# Altium project ТЕИЯ.464511.002 main.PrjPcb (part 3 of 3)

## Sheet Модуль ВЧ.SchDoc
size 594 x 420 mm; DocumentNumber: 9; SheetNumber: 9; SheetTotal: 11; ListNumber: 1
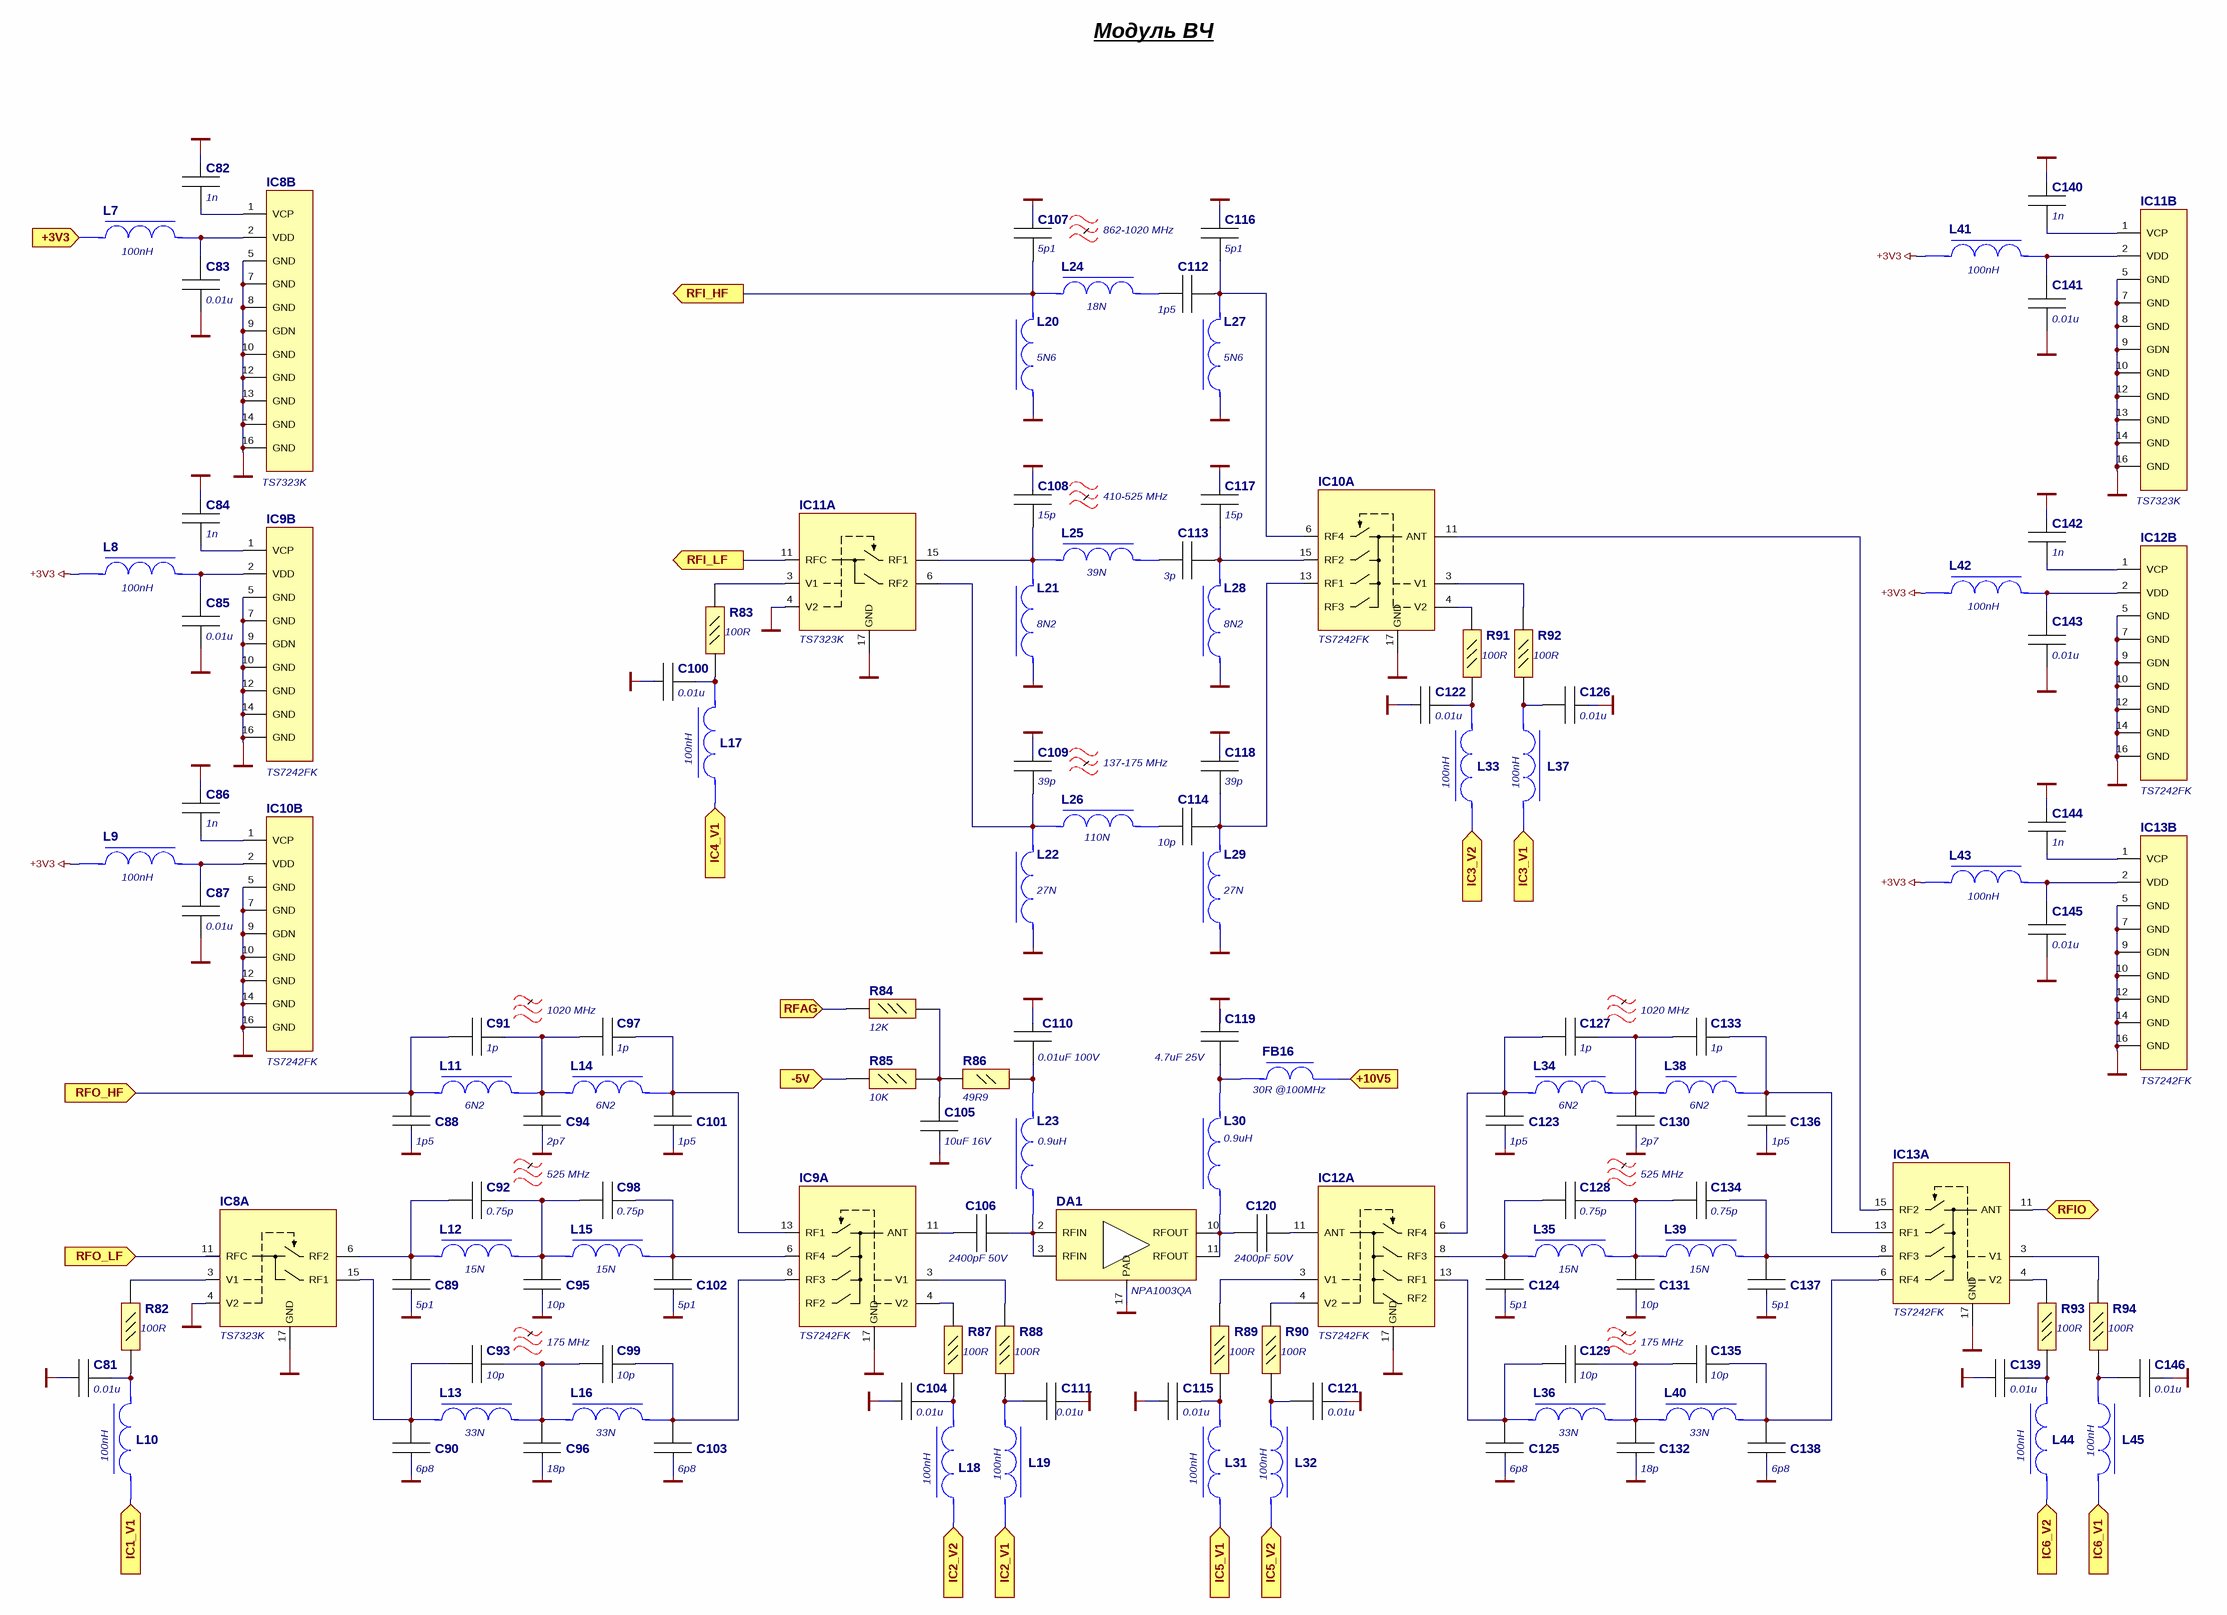
[diagram p8: Модуль ВЧ.SchDoc]

### Parts
C81  0.01u  [:CAP0402 100x50x50]
C82  1n  [:CAP0402 100x50x50]
C83  0.01u  [:CAP0402 100x50x50]
C84  1n  [:CAP0402 100x50x50]
C85  0.01u  [:CAP0402 100x50x50]
C86  1n  [:CAP0402 100x50x50]
C87  0.01u  [:CAP0402 100x50x50]
C88  1p5  [:CAP0603 C1608х08]
C89  5p1  [:CAP0603 C1608х08]
C90  6p8  [:CAP0603 C1608х08]
C91  1p  [:CAP0603 C1608х08]
C92  0.75p  [:CAP0603 C1608х08]
C93  10p  [:CAP0603 C1608х08]
C94  2p7  [:CAP0603 C1608х08]
C95  10p  [:CAP0603 C1608х08]
C96  18p  [:CAP0603 C1608х08]
C97  1p  [:CAP0603 C1608х08]
C98  0.75p  [:CAP0603 C1608х08]
C99  10p  [:CAP0603 C1608х08]
C100  0.01u  [:CAP0402 100x50x50]
C101  1p5  [:CAP0603 C1608х08]
C102  5p1  [:CAP0603 C1608х08]
C103  6p8  [:CAP0603 C1608х08]
C104  0.01u  [:CAP0402 100x50x50]
C105  10uF 16V  [:CAP0805 C2012X125]
C106  2400pF 50V  [:CAP0805 C2012X125]
C107  5p1  [:CAP0603 C1608х08]
C108  15p  [:CAP0603 C1608х08]
C109  39p  [:CAP0603 C1608х08]
C110  0.01uF 100V  [:CAP0603 C1608х08]
C111  0.01u  [:CAP0402 100x50x50]
C112  1p5  [:CAP0603 C1608х08]
C113  3p  [:CAP0603 C1608х08]
C114  10p  [:CAP0603 C1608х08]
C115  0.01u  [:CAP0402 100x50x50]
C116  5p1  [:CAP0603 C1608х08]
C117  15p  [:CAP0603 C1608х08]
C118  39p  [:CAP0603 C1608х08]
C119  4.7uF 25V  [:CAP0805 C2012X125]
C120  2400pF 50V  [:CAP0805 C2012X125]
C121  0.01u  [:CAP0402 100x50x50]
C122  0.01u  [:CAP0402 100x50x50]
C123  1p5  [:CAP0603 C1608х08]
C124  5p1  [:CAP0603 C1608х08]
C125  6p8  [:CAP0603 C1608х08]
C126  0.01u  [:CAP0402 100x50x50]
C127  1p  [:CAP0603 C1608х08]
C128  0.75p  [:CAP0603 C1608х08]
C129  10p  [:CAP0603 C1608х08]
C130  2p7  [:CAP0603 C1608х08]
C131  10p  [:CAP0603 C1608х08]
C132  18p  [:CAP0603 C1608х08]
C133  1p  [:CAP0603 C1608х08]
C134  0.75p  [:CAP0603 C1608х08]
C135  10p  [:CAP0603 C1608х08]
C136  1p5  [:CAP0603 C1608х08]
C137  5p1  [:CAP0603 C1608х08]
C138  6p8  [:CAP0603 C1608х08]
C139  0.01u  [:CAP0402 100x50x50]
C140  1n  [:CAP0402 100x50x50]
C141  0.01u  [:CAP0402 100x50x50]
C142  1n  [:CAP0402 100x50x50]
C143  0.01u  [:CAP0402 100x50x50]
C144  1n  [:CAP0402 100x50x50]
C145  0.01u  [:CAP0402 100x50x50]
C146  0.01u  [:CAP0402 100x50x50]
DA1  NPA1003QA  [:QFN16 P400X400X95-17N-D]
FB16  30R @100MHz  [:FER BLM18SP300SN1D]
IC8  TS7323K  [:QFN16 P300X300X80-17N-D]  (parts A,B of 2)
IC9  TS7242FK  [:QFN16 P300X300X80-17N-D]  (parts A,B of 2)
IC10  TS7242FK  [:QFN16 P300X300X80-17N-D]  (parts A,B of 2)
IC11  TS7323K  [:QFN16 P300X300X80-17N-D]  (parts A,B of 2)
IC12  TS7242FK  [:QFN16 P300X300X80-17N-D]  (parts A,B of 2)
IC13  TS7242FK  [:QFN16 P300X300X80-17N-D]  (parts A,B of 2)
L7  100nH  [:IND 0402]
L8  100nH  [:IND 0402]
L9  100nH  [:IND 0402]
L10  100nH  [:IND 0402]
L11  Manufacturer_Part_Number (part 2: value): 6N2  [:IND 0603 (1608)]
L12  Manufacturer_Part_Number (part 2: value): 15N  [:IND 0603 (1608)]  (hidden comment: LQW18AN...G8ZD)
L13  Manufacturer_Part_Number (part 2: value): 33N  [:IND 0603 (1608)]  (hidden comment: LQW18AN...G8ZD)
L14  Manufacturer_Part_Number (part 2: value): 6N2  [:IND 0603 (1608)]  (hidden comment: LQW18AN...G8ZD)
L15  Manufacturer_Part_Number (part 2: value): 15N  [:IND 0603 (1608)]  (hidden comment: LQW18AN...G8ZD)
L16  Manufacturer_Part_Number (part 2: value): 33N  [:IND 0603 (1608)]  (hidden comment: LQW18AN...G8ZD)
L17  100nH  [:IND 0402]
L18  100nH  [:IND 0402]
L19  100nH  [:IND 0402]
L20  Manufacturer_Part_Number (part 2: value): 5N6  [:IND 0603 (1608)]
L21  Manufacturer_Part_Number (part 2: value): 8N2  [:IND 0603 (1608)]  (hidden comment: LQW18AN...G8ZD)
L22  Manufacturer_Part_Number (part 2: value): 27N  [:IND 0603 (1608)]  (hidden comment: LQW18AN...G8ZD)
L23  0.9uH  [:IND 1008AF901XJLC]
L24  Manufacturer_Part_Number (part 2: value): 18N  [:IND 0603 (1608)]  (hidden comment: LQW18AN...G8ZD)
L25  Manufacturer_Part_Number (part 2: value): 39N  [:IND 0603 (1608)]  (hidden comment: LQW18AN...G8ZD)
L26  110N  [:IND 0603 (1608)]
L27  Manufacturer_Part_Number (part 2: value): 5N6  [:IND 0603 (1608)]  (hidden comment: LQW18AN...G8ZD)
L28  Manufacturer_Part_Number (part 2: value): 8N2  [:IND 0603 (1608)]  (hidden comment: LQW18AN...G8ZD)
L29  Manufacturer_Part_Number (part 2: value): 27N  [:IND 0603 (1608)]  (hidden comment: LQW18AN...G8ZD)
L30  0.9uH  [:IND 1008AF901XJLC]
L31  100nH  [:IND 0402]
L32  100nH  [:IND 0402]
L33  100nH  [:IND 0402]
L34  Manufacturer_Part_Number (part 2: value): 6N2  [:IND 0603 (1608)]  (hidden comment: LQW18AN...G8ZD)
L35  Manufacturer_Part_Number (part 2: value): 15N  [:IND 0603 (1608)]  (hidden comment: LQW18AN...G8ZD)
L36  Manufacturer_Part_Number (part 2: value): 33N  [:IND 0603 (1608)]  (hidden comment: LQW18AN...G8ZD)
L37  100nH  [:IND 0402]
L38  Manufacturer_Part_Number (part 2: value): 6N2  [:IND 0603 (1608)]  (hidden comment: LQW18AN...G8ZD)
L39  Manufacturer_Part_Number (part 2: value): 15N  [:IND 0603 (1608)]  (hidden comment: LQW18AN...G8ZD)
L40  Manufacturer_Part_Number (part 2: value): 33N  [:IND 0603 (1608)]  (hidden comment: LQW18AN...G8ZD)
L41  100nH  [:IND 0402]
L42  100nH  [:IND 0402]
L43  100nH  [:IND 0402]
L44  100nH  [:IND 0402]
L45  100nH  [:IND 0402]
R82  Manufacturer_Part_Number (part 2: value): 100R  [:RES0402]  (hidden comment: RC0402FR-07)
R83  Manufacturer_Part_Number (part 2: value): 100R  [:RES0402]  (hidden comment: RC0402FR-07)
R84  Manufacturer_Part_Number (part 2: value): 12K  [:RES0402]  (hidden comment: RC0402FR-07)
R85  Manufacturer_Part_Number (part 2: value): 10K  [:RES0402]  (hidden comment: RC0402FR-07)
R86  49R9  [:RES0805]
R87  Manufacturer_Part_Number (part 2: value): 100R  [:RES0402]  (hidden comment: RC0402FR-07)
R88  Manufacturer_Part_Number (part 2: value): 100R  [:RES0402]  (hidden comment: RC0402FR-07)
R89  Manufacturer_Part_Number (part 2: value): 100R  [:RES0402]  (hidden comment: RC0402FR-07)
R90  Manufacturer_Part_Number (part 2: value): 100R  [:RES0402]  (hidden comment: RC0402FR-07)
R91  Manufacturer_Part_Number (part 2: value): 100R  [:RES0402]  (hidden comment: RC0402FR-07)
R92  Manufacturer_Part_Number (part 2: value): 100R  [:RES0402]  (hidden comment: RC0402FR-07)
R93  Manufacturer_Part_Number (part 2: value): 100R  [:RES0402]  (hidden comment: RC0402FR-07)
R94  Manufacturer_Part_Number (part 2: value): 100R  [:RES0402]  (hidden comment: RC0402FR-07)

### Ports
+3V3 (in), +10V5 (in), -5V (in), IC1_V1 (in), IC2_V1 (in), IC2_V2 (in), IC3_V1 (in), IC3_V2 (in), IC4_V1 (in), IC5_V1 (in), IC5_V2 (in), IC6_V1 (in), IC6_V2 (in), RFAG (in), RFI_HF (out), RFI_LF (out), RFIO (bidir), RFO_HF (in), RFO_LF (in)

### Nets
+3V3: L7.1 L8.1 L9.1 L41.1 L42.1 L43.1 ; port +3V3
+10V5: FB16.2 ; port +10V5
-5V: R85.2 ; port -5V
GND: C81.2 C82.2 C83.1 C84.2 C85.1 C86.2 C87.1 C88.2 C89.2 C90.2 C94.2 C95.2 C96.2 C100.2 C101.2 C102.2 C103.2 C104.2 C105.1 C107.2 C108.2 C109.2 C110.1 C111.2 C115.2 C116.2 C117.2 C118.2 C119.1 C121.2 C122.2 C123.2 C124.2 C125.2 C126.2 C130.2 C131.2 C132.2 C136.2 C137.2 C138.2 C139.2 C140.2 C141.1 C142.2 C143.1 C144.2 C145.1 C146.2 DA1.17(PAD) IC8.4(V2) IC8.5(GND) IC8.7(GND) IC8.8(GND) IC8.9(GDN) IC8.10(GND) IC8.12(GND) IC8.13(GND) IC8.14(GND) IC8.16(GND) IC8.17(GND) IC9.5(GND) IC9.7(GND) IC9.9(GDN) IC9.10(GND) IC9.12(GND) IC9.14(GND) IC9.16(GND) IC9.17(GND) IC10.5(GND) IC10.7(GND) IC10.9(GDN) IC10.10(GND) IC10.12(GND) IC10.14(GND) IC10.16(GND) IC10.17(GND) IC11.4(V2) IC11.5(GND) IC11.7(GND) IC11.8(GND) IC11.9(GDN) IC11.10(GND) IC11.12(GND) IC11.13(GND) IC11.14(GND) IC11.16(GND) IC11.17(GND) IC12.5(GND) IC12.7(GND) IC12.9(GDN) IC12.10(GND) IC12.12(GND) IC12.14(GND) IC12.16(GND) IC12.17(GND) IC13.5(GND) IC13.7(GND) IC13.9(GDN) IC13.10(GND) IC13.12(GND) IC13.14(GND) IC13.16(GND) IC13.17(GND) L20.1 L21.1 L22.1 L27.1 L28.1 L29.1
NetC81_1: C81.1 L10.2 R82.1
NetC82_1: C82.1 IC8.1(VCP)
NetC83_2: C83.2 IC8.2(VDD) L7.2
NetC84_1: C84.1 IC9.1(VCP)
NetC85_2: C85.2 IC9.2(VDD) L8.2
NetC86_1: C86.1 IC10.1(VCP)
NetC87_2: C87.2 IC10.2(VDD) L9.2
NetC88_1: C88.1 C91.1 L11.1 ; port RFO_HF
NetC89_1: C89.1 C92.1 IC8.6(RF2) L12.1
NetC90_1: C90.1 C93.1 IC8.15(RF1) L13.1
NetC91_2: C91.2 C94.1 C97.1 L11.2 L14.1
NetC92_2: C92.2 C95.1 C98.1 L12.2 L15.1
NetC93_2: C93.2 C96.1 C99.1 L13.2 L16.1
NetC97_2: C97.2 C101.1 IC9.13(RF1) L14.2
NetC98_2: C98.2 C102.1 IC9.6(RF4) L15.2
NetC99_2: C99.2 C103.1 IC9.8(RF3) L16.2
NetC100_1: C100.1 L17.2 R83.1
NetC104_1: C104.1 L18.2 R87.1
NetC105_2: C105.2 R84.1 R85.1 R86.1
NetC106_1: C106.1 IC9.11(ANT)
NetC106_2: C106.2 DA1.2(RFIN) DA1.3(RFIN) L23.1
NetC107_1: C107.1 L20.2 L24.1 ; port RFI_HF
NetC108_1: C108.1 IC11.15(RF1) L21.2 L25.1
NetC109_1: C109.1 IC11.6(RF2) L22.2 L26.1
NetC110_2: C110.2 L23.2 R86.2
NetC111_1: C111.1 L19.2 R88.1
NetC112_1: C112.1 L24.2
NetC112_2: C112.2 C116.1 IC10.6(RF4) L27.2
NetC113_1: C113.1 L25.2
NetC113_2: C113.2 C117.1 IC10.15(RF2) L28.2
NetC114_1: C114.1 L26.2
NetC114_2: C114.2 C118.1 IC10.13(RF1) L29.2
NetC115_1: C115.1 L31.2 R89.1
NetC119_2: C119.2 FB16.1 L30.2
NetC120_1: C120.1 DA1.10(RFOUT) DA1.11(RFOUT) L30.1
NetC120_2: C120.2 IC12.11(ANT)
NetC121_1: C121.1 L32.2 R90.1
NetC122_1: C122.1 L33.2 R91.1
NetC123_1: C123.1 C127.1 IC12.6(RF4) L34.1
NetC124_1: C124.1 C128.1 IC12.8(RF3) L35.1
NetC125_1: C125.1 C129.1 IC12.13(RF1) L36.1
NetC126_1: C126.1 L37.2 R92.1
NetC127_2: C127.2 C130.1 C133.1 L34.2 L38.1
NetC128_2: C128.2 C131.1 C134.1 L35.2 L39.1
NetC129_2: C129.2 C132.1 C135.1 L36.2 L40.1
NetC133_2: C133.2 C136.1 IC13.13(RF1) L38.2
NetC134_2: C134.2 C137.1 IC13.8(RF3) L39.2
NetC135_2: C135.2 C138.1 IC13.6(RF4) L40.2
NetC139_1: C139.1 L44.2 R93.1
NetC140_1: C140.1 IC11.1(VCP)
NetC141_2: C141.2 IC11.2(VDD) L41.2
NetC142_1: C142.1 IC12.1(VCP)
NetC143_2: C143.2 IC12.2(VDD) L42.2
NetC144_1: C144.1 IC13.1(VCP)
NetC145_2: C145.2 IC13.2(VDD) L43.2
NetC146_1: C146.1 L45.2 R94.1
NetC162_1: IC11.11(RFC) ; port RFI_LF
NetC164_1: IC8.11(RFC) ; port RFO_LF
NetIC7_D6: L45.1 ; port IC6_V1
NetIC7_F3: L37.1 ; port IC3_V1
NetIC7_F4: L10.1 ; port IC1_V1
NetIC7_G3: L33.1 ; port IC3_V2
NetIC7_G6: L44.1 ; port IC6_V2
NetIC7_G9: L17.1 ; port IC4_V1
NetIC7_H5: L18.1 ; port IC2_V2
NetIC7_N2: R84.2 ; port RFAG
NetIC7_N4: L19.1 ; port IC2_V1
NetIC7_N5: L31.1 ; port IC5_V1
NetIC7_N6: L32.1 ; port IC5_V2
NetIC8_3: IC8.3(V1) R82.2
NetIC9_3: IC9.3(V1) R88.2
NetIC9_4: IC9.4(V2) R87.2
NetIC10_3: IC10.3(V1) R92.2
NetIC10_4: IC10.4(V2) R91.2
NetIC10_11: IC10.11(ANT) IC13.15(RF2)
NetIC11_3: IC11.3(V1) R83.2
NetIC12_3: IC12.3(V1) R89.2
NetIC12_4: IC12.4(V2) R90.2
NetIC13_3: IC13.3(V1) R94.2
NetIC13_4: IC13.4(V2) R93.2
NetIC13_11: IC13.11(ANT) ; port RFIO

Not connected (* = marked no-connect by the designer): IC9 15(RF2); IC10 8(RF3); IC12 15(RF2)

### Notes on the sheet
- Модуль ВЧ
- 862-1020 MHz
- 410-525 MHz
- 137-175 MHz
- (near C97) 1020 MHz
- (near C133) 1020 MHz
- (near C98) 525 MHz
- (near C134) 525 MHz
- (near C99) 175 MHz
- (near C135) 175 MHz
- Подп. и дата
- Инв. № дубл.
- Взам. инв. №
- Инв. № подл.
- Лист
- Изм.
- № докум.
- Подп.
- Дата
- Копировал
- Формат А2

### Library data of the parts
C81 C83 C85 C87 C100 C104 C111 C115 C121 C122 C126 C139 C141 C143 C145 C146 = GRM1555CYA103JE01D: ±5% 35V Ceramic Capacitor C0G, NP0 0402 (1005 Metric); Manufacturer_Name: Murata Electronics; Short Description: 0402 0.01u 35V; Datasheet Link: https://search.murata.co.jp/Ceramy/image/img/A01X/G101/ENG/GRM1555CYA103JE01-01A.pdf; Height: 0.55mm; Manufacturer_Part_Number: GRM1555CYA103JE01D
C82 C84 C86 C140 C142 C144 = GRM1555C1H102JA01J: ±5% 50V Ceramic Capacitor C0G, NP0 0402 (1005 Metric); Manufacturer_Name: Murata Electronics; Short Description: 0402 1n 50V; Height: 0.55mm; Manufacturer_Part_Number: GRM1555C1H102JA01J
C88 C101 C112 C123 C136 = GQM1875C2E1R5BB12D: Ceramic Capacitor ±0.1pF 250V C0G, NP0 0603 (1608 Metric); Manufacturer_Name: Murata Electronics; Short Description: 0603 ±0.1pF NP0; Manufacturer_Part_Number: GQM1875C2E1R5BB12D
C89 C102 C107 C116 C124 C137 = GQM1875C2E5R1BB12D: Ceramic Capacitor ±0.1pF 250V C0G, NP0 0603 (1608 Metric); Manufacturer_Name: Murata Electronics; Short Description: 0603 ±0.1pF NP0; Manufacturer_Part_Number: GQM1875C2E5R1BB12D
C90 C103 C125 C138 = GQM1875C2E6R8BB12D: Ceramic Capacitor ±0.1pF 250V C0G, NP0 0603 (1608 Metric); Manufacturer_Name: Murata Electronics; Short Description: 0603 ±0.1pF NP0; Manufacturer_Part_Number: GQM1875C2E6R8BB12D
C91 C97 C127 C133 = GQM1875C2E1R0BB12D: Ceramic Capacitor ±0.1pF 250V C0G, NP0 0603 (1608 Metric); Manufacturer_Name: Murata Electronics; Short Description: 0603 ±0.1pF NP0; Manufacturer_Part_Number: GQM1875C2E1R0BB12D
C92 C98 C128 C134 = GQM1875C2ER75BB12D: Ceramic Capacitor ±0.1pF 250V C0G, NP0 0603 (1608 Metric); Manufacturer_Name: Murata Electronics; Short Description: 0603 ±0.1pF NP0; Manufacturer_Part_Number: GQM1875C2ER75BB12D
C93 C95 C99 C114 C129 C131 C135 = GQM1875C2E100FB12D: Ceramic Capacitor ±1% 250V C0G, NP0 0603 (1608 Metric); Manufacturer_Name: Murata Electronics; Short Description: 0603 ±1% NP0; Manufacturer_Part_Number: GQM1875C2E100FB12D
C94 C130 = GQM1875C2E2R7BB12D: Ceramic Capacitor ±0.1pF 250V C0G, NP0 0603 (1608 Metric); Manufacturer_Name: Murata Electronics; Short Description: 0603 ±0.1pF NP0; Manufacturer_Part_Number: GQM1875C2E2R7BB12D
C96 C132 = GQM1875C2E180FB12D: Ceramic Capacitor ±1% 250V C0G, NP0 0603 (1608 Metric); Manufacturer_Name: Murata Electronics; Short Description: 0603 ±1% NP0; Manufacturer_Part_Number: GQM1875C2E180FB12D
C105 = C2012X5R1C106M085AC: CAP CER 10uF 16V X5R 0805; Manufacturer_Name: TDK; Short Description: 0805 10uF 16V; Datasheet Link: https://product.tdk.com/info/en/documents/chara_sheet/C2012X5R1C106M085AC.pdf; Height: 1.45mm; Manufacturer_Part_Number: C2012X5R1C106M085AC; Mouser Part Number: 810-C2012X5R1C106M-2; Mouser Price/Stock: https://www.mouser.co.uk/ProductDetail/TDK/C2012X5R1C106M085AC?qs=LcTL%2F5vFEzFm8m4UBfhWvw%3D%3D; Arrow Part Number: C2012X5R1C106M085AC; Arrow Price/Stock: https://www.arrow.com/en/products/c2012x5r1c106m085ac/tdk
C106 C120 = C08BL242X-5UN-X0T: 2400pF 50V Ceramic Capacitor 0805 (2012 Metric); Manufacturer_Name: Knowles Novacap; Short Description: 0805 2400pF 50V; Manufacturer_Part_Number: C08BL242X-5UN-X0T
C108 C117 = GQM1875C2E150FB12D: Ceramic Capacitor ±1% 250V C0G, NP0 0603 (1608 Metric); Manufacturer_Name: Murata Electronics; Short Description: 0603 ±1% NP0; Manufacturer_Part_Number: GQM1875C2E150FB12D
C109 C118 = GQM1875C2E390FB12D: Ceramic Capacitor ±1% 250V C0G, NP0 0603 (1608 Metric); Manufacturer_Name: Murata Electronics; Short Description: 0603 ±1% NP0; Manufacturer_Part_Number: GQM1875C2E390FB12D
C110 = 06031C103JAT2A: CAP CER 0.01uF 100V X7R 0603; Manufacturer_Name: AVX; Short Description: 0603 0.01uF 100V; Datasheet Link: http://datasheets.avx.com/X7RDielectric.pdf; Height: 0.9mm; Manufacturer_Part_Number: 06031C103JAT2A; Mouser Part Number: 581-06031C103J; Mouser Price/Stock: https://www.mouser.co.uk/ProductDetail/AVX/06031C103JAT2A?qs=PvDVvsUKiFRCqwRkH01KSw%3D%3D; Arrow Part Number: 06031C103JAT2A; Arrow Price/Stock: https://www.arrow.com/en/products/06031c103jat2a/avx
C113 = GQM1875C2E3R0BB12D: Ceramic Capacitor ±0.1pF 250V C0G, NP0 0603 (1608 Metric); Manufacturer_Name: Murata Electronics; Short Description: 0603 ±0.1pF NP0; Manufacturer_Part_Number: GQM1875C2E3R0BB12D
C119 = GRM21BZ71E475KE15L: CAP CER 4.7uF 25V X7R 0805; Manufacturer_Name: Murata Electronics; Short Description: 0805 4.7uF 25V; Datasheet Link: https://search.murata.co.jp/Ceramy/image/img/A01X/G101/ENG/GRM21BZ71E475KE15-01.pdf; Height: 1.45mm; Manufacturer_Part_Number: GRM21BZ71E475KE15L
DA1 = NPA1003QA: GaN 20 - 1500 MHz Power Amplifier 16dB 5W; Manufacturer_Name: MACOM; Short Description: 16dB 5W; Datasheet Link: https://cdn.macom.com/datasheets/NPA1003QA.pdf; Height: 0.95mm; Manufacturer_Part_Number: NPA1003QA; Mouser Part Number: 937-NPA1003QA; Mouser Price/Stock: https://www.mouser.co.uk/ProductDetail/MACOM/NPA1003QA?qs=%2F9lm7XkpNBiuAdOeTJvWuA%3D%3D
FB16 = BLM18SP300SN1D: 30 Ohms @ 100MHz 1 Power Line Ferrite Bead 0603 (1608 Metric) 6A 8mOhm; Manufacturer_Name: Murata Electronics; Short Description: 0603 30R @100MHz; Datasheet Link: http://www.murata.com/~/media/webrenewal/support/library/catalog/products/emc/emifil/c31e.ashx?la=en-gb; Height: 0.95mm; Manufacturer_Part_Number: BLM18SP300SN1D; Mouser Part Number: 81-BLM18SP300SN1D; Mouser Price/Stock: https://www.mouser.co.uk/ProductDetail/Murata-Electronics/BLM18SP300SN1D/?qs=W%2FMpXkg%252BdQ4o%252BOP%252B6m8FYA%3D%3D
IC8 IC11 = TS7323K: SPDT Switch 1MHz to 1GHz; Manufacturer_Name: Tagore Technology; Manufacturer_Part_Number: TS7323KMTRPBF; Short Description: SPDT
IC9 IC10 IC12 IC13 = TS7242FK: SP4T Switch 10MHz to 3GHz; Manufacturer_Name: Tagore Technology; Manufacturer_Part_Number: TS7242FKMTRPBF; Short Description: SP4T
L7-L10 L17-L19 L31-L33 L37 L41-L45 = LQG15HNR10J02D: Unshielded Multilayer Inductor 0402 5%; Manufacturer_Name: Murata Electronics; Short Description: 100nH 200mA 1.6Ohm; Manufacturer_Part_Number: LQG15HNR10J02D
L11-L16 L20-L22 L24 L25 L27-L29 L34-L36 L38-L40 = LQW18AN...G8ZD: Unshielded Non-Magnetic Core Inductor 0603 2% / Value Range: 2.2n ... 390n / Example for value from 2.2n to 94n: / 2.2n = 2N2 / .... / 94n = 94N / Example for value from 100n to 390n: / 100n = R10 / .... / 390n = R39; Manufacturer_Name: Murata Electronics; Manufacturer_Part_Number (part 3: after value): G8ZD; Short Description: 0603 2%; Datasheet Link: https://search.murata.co.jp/Ceramy/image/img/P02/JELF243A-9133.pdf; Manufacturer_Part_Number: LQW18AN
L23 L30 = 1008AF-901XJLC: Fixed Inductors 1008 0.9uH Unshld 5% 1.3A 100mOhms / Current - Saturation (Isat) 1.4 A / Current Rating (Amps) 1.3 A / Frequency - Self Resonant  415 MHz; Manufacturer_Name: Coilcraft; Short Description: 0.9uH 1.3A 100mOhm; Manufacturer_Part_Number: 1008AF-901XJLC
L26 = LQW18AN...G8ZD: Unshielded Non-Magnetic Core Inductor 0603 2% / Value Range: 2.2n ... 390n / Example for value from 2.2n to 94n: / 2.2n = 2N2 / .... / 94n = 94N / Example for value from 100n to 390n: / 100n = R10 / .... / 390n = R39; Manufacturer_Name: Murata Electronics; Manufacturer_Part_Number (part 3: after value): G8ZD; Manufacturer_Part_Number (part 2: value): R11; Short Description: 0603 2%; Datasheet Link: https://search.murata.co.jp/Ceramy/image/img/P02/JELF243A-9133.pdf; Manufacturer_Part_Number: LQW18AN
R82-R85 R87-R94 = RC0402FR-07: Resistor 0402 1% 1/16W / Value Range: 1Ω ... 10 MΩ / Value Example: / 0R = 0Ω / 97R6 = 97.6Ω / 9K76 = 9760Ω / 1M = 1,000,000Ω; Manufacturer_Name: YAGEO; Manufacturer_Part_Number (part 3: after value): L; Short Description: 0402 1%; Datasheet Link: http://www.yageo.com/documents/recent/PYu-RC0402_51_RoHS_L_6_r.pdf; Height: 0.4mm; Manufacturer_Part_Number: RC0402FR-07; Parameter 1: *
R86 = ERJ-6ENF49R9V: 49.9 Ohms ±1% 0.125W, 1/8W Chip Resistor 0805 (2012 Metric) Automotive AEC-Q200 Thick Film; Manufacturer_Name: Panasonic; Datasheet Link: https://industrial.panasonic.com/cdbs/www-data/pdf/RDA0000/AOA0000C84.pdf; Height: 0.7mm; Manufacturer_Part_Number: ERJ-6ENF49R9V; Mouser Part Number: 667-ERJ-6ENF49R9V; Mouser Price/Stock: https://www.mouser.co.uk/ProductDetail/Panasonic/ERJ-6ENF49R9V?qs=qCGL2%252BBFAqUwh1urNYOtNA%3D%3D; Arrow Part Number: ERJ-6ENF49R9V; Arrow Price/Stock: https://www.arrow.com/en/products/erj-6enf49r9v/panasonic

## Sheet Модуль питания.SchDoc
size 209 x 297 mm; DocumentNumber: 7; SheetNumber: 7; SheetTotal: 11; ListNumber: 1
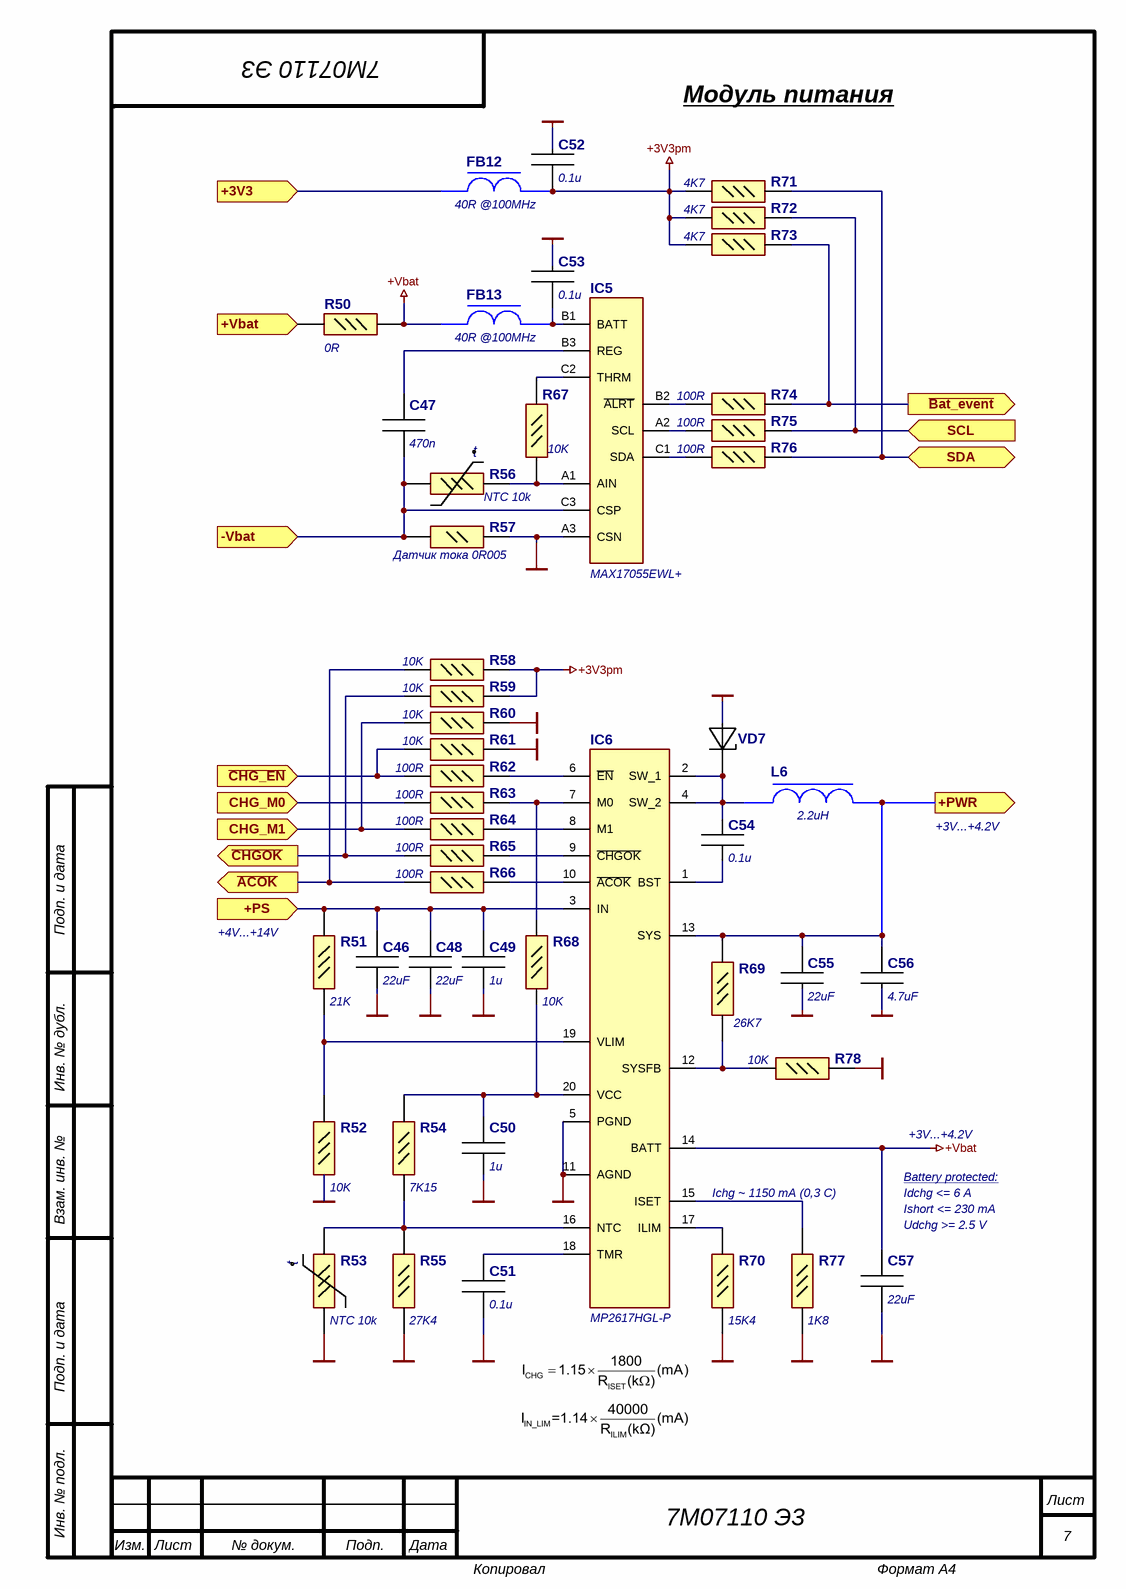
[diagram p9: Модуль питания.SchDoc]

### Parts
C46  22uF  [:CAP0805 C2012X125]
C47  470n  [:CAP0603 C1608х08]
C48  22uF  [:CAP0805 C2012X125]
C49  1u  [:CAP0603 C1608х08]
C50  1u  [:CAP0603 C1608х08]
C51  0.1u  [:CAP0402 100x50x50]
C52  0.1u  [:CAP0402 100x50x50]
C53  0.1u  [:CAP0402 100x50x50]
C54  0.1u  [:CAP0402 100x50x50]
C55  22uF  [:CAP0805 C2012X125]
C56  4.7uF  [:CAP0805 C2012X125]
C57  22uF  [:CAP0805 C2012X125]
FB12  40R @100MHz  [:FER MMZ1005Y400CTD25]
FB13  40R @100MHz  [:FER MMZ1005Y400CTD25]
IC5  MAX17055EWL+  [:BGA9 P150X140X64]
IC6  MP2617HGL-P  [:QFN20 P400X300X100-20N]
L6  2.2uH  [:IND4020]
R50  Manufacturer_Part_Number (part 2: value): 0R  [:RES0402]  (hidden comment: RC0402FR-07)
R51  Manufacturer_Part_Number (part 2: value): 21K  [:RES0402]  (hidden comment: RC0402FR-07)
R52  Manufacturer_Part_Number (part 2: value): 10K  [:RES0402]  (hidden comment: RC0402FR-07)
R53  NTC 10k  [:RES0402]
R54  Manufacturer_Part_Number (part 2: value): 7K15  [:RES0402]  (hidden comment: RC0402FR-07)
R55  Manufacturer_Part_Number (part 2: value): 27K4  [:RES0402]  (hidden comment: RC0402FR-07)
R56  NTC 10k  [:RES0402]
R57  Датчик тока 0R005  [:RES0402]
R58  Manufacturer_Part_Number (part 2: value): 10K  [:RES0402]  (hidden comment: RC0402FR-07)
R59  Manufacturer_Part_Number (part 2: value): 10K  [:RES0402]  (hidden comment: RC0402FR-07)
R60  Manufacturer_Part_Number (part 2: value): 10K  [:RES0402]  (hidden comment: RC0402FR-07)
R61  Manufacturer_Part_Number (part 2: value): 10K  [:RES0402]  (hidden comment: RC0402FR-07)
R62  Manufacturer_Part_Number (part 2: value): 100R  [:RES0402]  (hidden comment: RC0402FR-07)
R63  Manufacturer_Part_Number (part 2: value): 100R  [:RES0402]  (hidden comment: RC0402FR-07)
R64  Manufacturer_Part_Number (part 2: value): 100R  [:RES0402]  (hidden comment: RC0402FR-07)
R65  Manufacturer_Part_Number (part 2: value): 100R  [:RES0402]  (hidden comment: RC0402FR-07)
R66  Manufacturer_Part_Number (part 2: value): 100R  [:RES0402]  (hidden comment: RC0402FR-07)
R67  Manufacturer_Part_Number (part 2: value): 10K  [:RES0402]  (hidden comment: RC0402FR-07)
R68  Manufacturer_Part_Number (part 2: value): 10K  [:RES0402]  (hidden comment: RC0402FR-07)
R69  Manufacturer_Part_Number (part 2: value): 26K7  [:RES0402]  (hidden comment: RC0402FR-07)
R70  Manufacturer_Part_Number (part 2: value): 15K4  [:RES0402]  (hidden comment: RC0402FR-07)
R71  Manufacturer_Part_Number (part 2: value): 4K7  [:RES0402]  (hidden comment: RC0402FR-07)
R72  Manufacturer_Part_Number (part 2: value): 4K7  [:RES0402]  (hidden comment: RC0402FR-07)
R73  Manufacturer_Part_Number (part 2: value): 4K7  [:RES0402]  (hidden comment: RC0402FR-07)
R74  Manufacturer_Part_Number (part 2: value): 100R  [:RES0402]  (hidden comment: RC0402FR-07)
R75  Manufacturer_Part_Number (part 2: value): 100R  [:RES0402]  (hidden comment: RC0402FR-07)
R76  Manufacturer_Part_Number (part 2: value): 100R  [:RES0402]  (hidden comment: RC0402FR-07)
R77  Manufacturer_Part_Number (part 2: value): 1K8  [:RES0402]  (hidden comment: RC0402FR-07)
R78  Manufacturer_Part_Number (part 2: value): 10K  [:RES0402]  (hidden comment: RC0402FR-07)
VD7  40V 1.5A  [:DIODE CST2C]  (value not drawn)

### Ports
+3V3 (in), +PS (in), +PWR (out), +Vbat (in), -Vbat (in), CHG_M0 (in), CHG_M1 (in), SCL (in), SDA (bidir), ~{ACOK} (out), ~{Bat_event} (out), ~{CHG_EN} (in), ~{CHGOK} (out)

### Nets
+3V3: FB12.2 ; port +3V3
+3V3pm: C52.2 FB12.1 R58.2 R59.2 R71.1 R72.1 R73.1
+PS: C46.2 C48.2 C49.2 IC6.3(IN) R51.2 ; port +PS
+PWR: C55.2 C56.2 IC6.13(SYS) L6.2 R69.2 ; port +PWR
+Vbat: C57.2 FB13.2 IC6.14(BATT) R50.2
GND: C46.1 C48.1 C49.1 C50.1 C51.1 C52.1 C53.2 C55.1 C56.1 C57.1 IC5.A3(CSN) IC6.5(PGND) IC6.11(AGND) R52.1 R53.1 R55.1 R57.2 R60.2 R61.2 R70.1 R77.1 R78.2 VD7.2(A)
NetC47_1: C47.1 IC5.C3(CSP) R56.1 R57.1 ; port -Vbat
NetC47_2: C47.2 IC5.B3(REG)
NetC50_2: C50.2 IC6.20(VCC) R54.2 R68.1
NetC51_2: C51.2 IC6.18(TMR)
NetC53_1: C53.1 FB13.1 IC5.B1(BATT)
NetC54_1: C54.1 IC6.2(SW_1) IC6.4(SW_2) L6.1 VD7.1(K)
NetC54_2: C54.2 IC6.1(BST)
NetIC5_A1: IC5.A1(AIN) R56.2 R67.1
NetIC5_A2: IC5.A2(SCL) R75.1
NetIC5_B2: IC5.B2(~{ALRT}) R74.1
NetIC5_C1: IC5.C1(SDA) R76.1
NetIC5_C2: IC5.C2(THRM) R67.2
NetIC6_6: IC6.6(~{EN}) R62.2
NetIC6_7: IC6.7(M0) R63.2 R68.2
NetIC6_8: IC6.8(M1) R64.2
NetIC6_9: IC6.9(~{CHGOK}) R65.2
NetIC6_10: IC6.10(~{ACOK}) R66.2
NetIC6_12: IC6.12(SYSFB) R69.1 R78.1
NetIC6_15: IC6.15(ISET) R77.2
NetIC6_16: IC6.16(NTC) R53.2 R54.1 R55.2
NetIC6_17: IC6.17(ILIM) R70.2
NetIC6_19: IC6.19(VLIM) R51.1 R52.2
NetIC7_A4: R61.1 R62.1 ; port ~{CHG_EN}
NetIC7_B13: R58.1 R66.1 ; port ~{ACOK}
NetIC7_C4: R72.2 R75.2 ; port SCL
NetIC7_C6: R63.1 ; port CHG_M0
NetIC7_C9: R60.1 R64.1 ; port CHG_M1
NetIC7_D4: R71.2 R76.2 ; port SDA
NetIC7_E7: R59.1 R65.1 ; port ~{CHGOK}
NetIC7_J7: R73.2 R74.2 ; port ~{Bat_event}
NetR50_1: R50.1 ; port +Vbat

### Notes on the sheet
- (near C52) Модуль питания
- +3V...+4.2V
- (near R51) +4V...+14V
- Ichg ~ 1150 mA (0,3 С)
- Idchg <= 6 A
- Battery protected:
- (near C57) Udchg >= 2.5 V
- Ishort <= 230 mA
- Подп. и дата
- Инв. № дубл.
- Взам. инв. №
- Инв. № подл.
- Лист
- Изм.
- № докум.
- Подп.
- Дата
- Копировал
- Формат А4
- (in symbol NCP15XH103D03RC) t

### Library data of the parts
C46 C48 C55 C57 = GRM21BR61C226ME44L: CAP CER 22uF 16V X5R; Manufacturer_Name: Murata Electronics; Short Description: 0805 22uF 16V; Datasheet Link: https://psearch.en.murata.com/capacitor/product/GRM21BR61C226ME44%23.html; Height: 1.45mm; Manufacturer_Part_Number: GRM21BR61C226ME44L; Mouser Part Number: 81-GRM21BR61C226ME4L; Mouser Price/Stock: https://www.mouser.co.uk/ProductDetail/Murata-Electronics/GRM21BR61C226ME44L?qs=H45D%252BQBid9ZSEksDj3jAIw%3D%3D; Arrow Part Number: GRM21BR61C226ME44L; Arrow Price/Stock: https://www.arrow.com/en/products/grm21br61c226me44l/murata-manufacturing
C47 = GCM188R71E474KA64D: ±10% 25V Ceramic Capacitor X7R 0603 (1608 Metric); Manufacturer_Name: Murata Electronics; Short Description: 0603 470n 25V; Height: 0.9mm; Manufacturer_Part_Number: GCM188R71E474KA64D
C49 C50 = GCM188R71E105KA64D: ±10% 25V Ceramic Capacitor X7R 0603 (1608 Metric); Manufacturer_Name: Murata Electronics; Short Description: 0603 1u 25V; Height: 0.9mm; Manufacturer_Part_Number: GCM188R71E105KA64D
C51-C54 = GRM155R71E104KE14J: ±10% 25V Ceramic Capacitor X7R 0402 (1005 Metric); Manufacturer_Name: Murata Electronics; Short Description: 0402 0.1uF 25V; Datasheet Link: http://www.murata.com/~/media/webrenewal/support/library/catalog/products/capacitor/mlcc/c02e.pdf; Height: 0.55mm; Manufacturer_Part_Number: GRM155R71E104KE14J; Mouser Part Number: 81-GRM155R71E104KE4J; Mouser Price/Stock: https://www.mouser.co.uk/ProductDetail/Murata-Electronics/GRM155R71E104KE14J?qs=hNud%2FORuBR2EQtvG2InwAQ%3D%3D; Arrow Part Number: GRM155R71E104KE14J; Arrow Price/Stock: https://www.arrow.com/en/products/grm155r71e104ke14j/murata-manufacturing
C56 = GRM21BZ71E475KE15L: as C119 on sheet Модуль ВЧ; Datasheet Link: https://search.murata.co.jp/Ceramy/image/img/A01X/G101/ENG/GRM21BZ71E475KE15-01.pdf; Height: 1.45mm; Manufacturer_Part_Number: GRM21BZ71E475KE15L
FB12 FB13 = MMZ1005Y400CTD25: 40 Ohms @ 100MHz 1 Signal Line Ferrite Bead 0402 (1005 Metric) 550mA 100mOhm; Manufacturer_Name: TDK; Short Description: 0402 40R @100MHz; Datasheet Link: https://www.arrow.com/en/products/mmz1005y400ctd25/tdk; Height: 0.55mm; Manufacturer_Part_Number: MMZ1005Y400CTD25; Mouser Part Number: 810-MMZ1005Y400CTD25; Mouser Price/Stock: https://www.mouser.com/Search/Refine.aspx?Keyword=810-MMZ1005Y400CTD25; Arrow Part Number: MMZ1005Y400CTD25; Arrow Price/Stock: https://www.arrow.com/en/products/mmz1005y400ctd25/tdk
IC5 = MAX17055EWL+: Battery Monitor ModelGauge m5 EZ; Manufacturer_Name: Maxim Integrated; Datasheet Link: https://componentsearchengine.com/Datasheets/1/MAX17055EWL+.pdf; Height: 0.69mm; Manufacturer_Part_Number: MAX17055EWL+; Mouser Part Number: 700-MAX17055EWL+; Mouser Price/Stock: https://www.mouser.com/Search/Refine.aspx?Keyword=700-MAX17055EWL%2B
IC6 = MP2617HGL-P: 3А charge controller With NVDC Power Path; Manufacturer_Name: Monolithic Power Systems (MPS); Datasheet Link: https://www.monolithicpower.com/pub/media/document/m/p/mp2617h_r1.03.pdf; Height: 1mm; Manufacturer_Part_Number: MP2617HGL-P; Mouser Part Number: 946-MP2617HGL-P; Mouser Price/Stock: https://www.mouser.co.uk/ProductDetail/Monolithic-Power-Systems-MPS/MP2617HGL-P?qs=IW9Tsl75qsV295J2ZL59tA%3D%3D
L6 = 74438356022: 2.2uH Shielded Molded Inductor 4.7A 35mOhm Max 2-SMD / Current - Saturation (Isat) 6.2A / Current Rating (Amps) 4.7A / Self Resonant 34MHz; Manufacturer_Name: Würth Elektronik; Short Description: 2.2uH 4.7A 35mOhm; Manufacturer_Part_Number: 74438356022
R50-R52 R54 R55 R58-R78 = RC0402FR-07: as R82-R85 on sheet Модуль ВЧ; Datasheet Link: http://www.yageo.com/documents/recent/PYu-RC0402_51_RoHS_L_6_r.pdf; Height: 0.4mm; Manufacturer_Part_Number: RC0402FR-07; Parameter 1: *
R53 R56 = NCP15XH103D03RC: THERMISTOR NTC 10KOHM 3380K 0402; Manufacturer_Name: Murata Electronics; Short Description: 0402 NTC 10k; Datasheet Link: https://www.murata.com/en-eu/api/pdfdownloadapi?cate=luNTCforTempeSenso&partno=NCP15XH103D03RC; Height: 0.55mm; Manufacturer_Part_Number: NCP15XH103D03RC; Mouser Part Number: 81-NCP15XH103D03RC; Mouser Price/Stock: https://www.mouser.co.uk/ProductDetail/Murata-Electronics/NCP15XH103D03RC?qs=xRHrB6DKEaKERViC4X8eqg%3D%3D; Arrow Part Number: NCP15XH103D03RC; Arrow Price/Stock: https://www.arrow.com/en/products/ncp15xh103d03rc/murata-manufacturing
R57 = LVT04R0050FER: Resistor 0402 1% 0.33W; Manufacturer_Name: Ohmite; Short Description: 0402 1% 0R005; Manufacturer_Part_Number: LVT04R0050FER; Mouser Part Number: 594-MCS04020C6801FE0
VD7 = CCS15S40,L3F: Diode Schottky 40V 1.5A / @If 550mV @ 1.5A / @Vr 200µA @ 40V; Manufacturer_Name: Toshiba; Short Description: 0603 40V 1.5A; Manufacturer_Part_Number: CCS15S40,L3F

## Sheet DC-DC модуль +10V5.SchDoc
size 209 x 297 mm; DocumentNumber: 4; SheetNumber: 4; SheetTotal: 11; ListNumber: 1
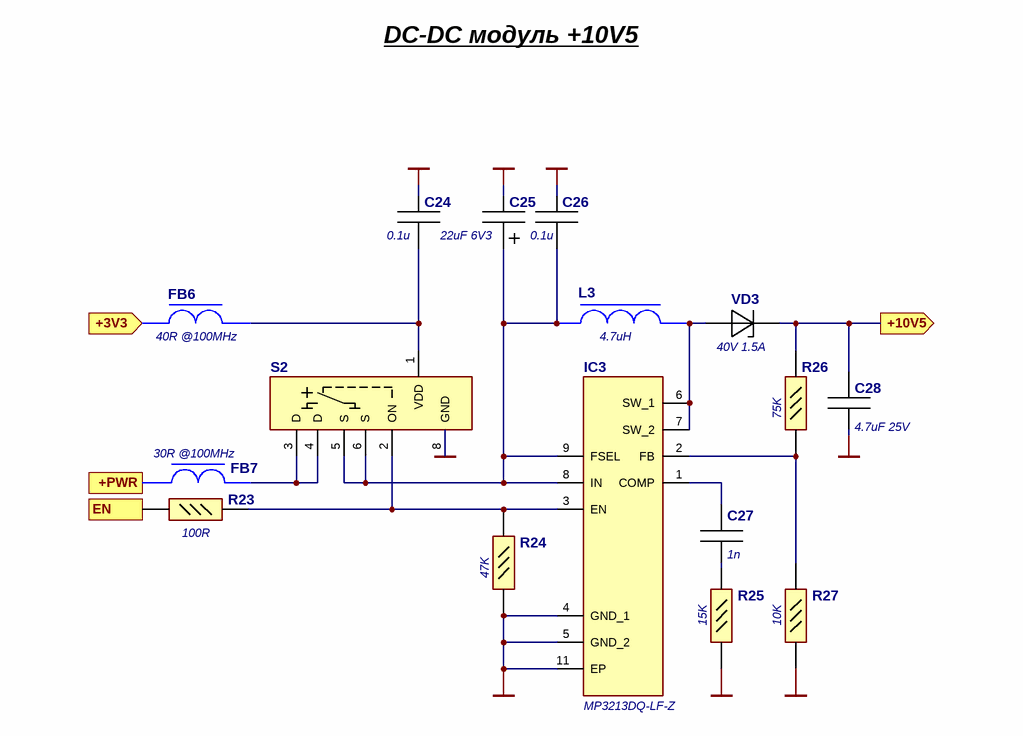
[diagram p10: DC-DC модуль +10V5.SchDoc]

### Parts
C24  0.1u  [:CAP0402 100x50x50]
C25  22uF 6V3  [:CAP1206 C3216-18]
C26  0.1u  [:CAP0402 100x50x50]
C27  1n  [:CAP0402 100x50x50]
C28  4.7uF 25V  [:CAP0805 C2012X125]
FB6  40R @100MHz  [:FER MMZ1005Y400CTD25]
FB7  30R @100MHz  [:FER BLM18SP300SN1D]
IC3  MP3213DQ-LF-Z  [:QFN10 P300X300X100-11N-D]
L3  4.7uH  [:IND1210 C3225]
R23  Manufacturer_Part_Number (part 2: value): 100R  [:RES0402]  (hidden comment: RC0402FR-07)
R24  Manufacturer_Part_Number (part 2: value): 47K  [:RES0402]  (hidden comment: RC0402FR-07)
R25  Manufacturer_Part_Number (part 2: value): 15K  [:RES0402]  (hidden comment: RC0402FR-07)
R26  Manufacturer_Part_Number (part 2: value): 75K  [:RES0402]  (hidden comment: RC0402FR-07)
R27  Manufacturer_Part_Number (part 2: value): 10K  [:RES0402]  (hidden comment: RC0402FR-07)
S2  4A 7.8mOhm  [:TRAN SLG59M309V]  (value not drawn)
VD3  40V 1.5A  [:DIODE CST2C]

### Ports
+3V3 (in), +10V5 (out), +PWR (in), EN (in)

### Nets
+3V3: FB6.2 ; port +3V3
+10V5: C28.2 R26.2 VD3.1(K) ; port +10V5
+PWR: FB7.1 ; port +PWR
GND: C24.1 C25.2 C26.1 C28.1 IC3.4(GND_1) IC3.5(GND_2) IC3.11(EP) R24.1 R25.1 R27.1 S2.8(GND)
PS_10V5_ON: R23.1 ; port EN
NetC24_2: C24.2 FB6.1 S2.1(VDD)
NetC25_1: C25.1(+) C26.2 IC3.8(IN) IC3.9(FSEL) L3.1 S2.5(S) S2.6(S)
NetC27_1: C27.1 R25.2
NetC27_2: C27.2 IC3.1(COMP)
NetFB7_2: FB7.2 S2.3(D) S2.4(D)
NetIC3_2: IC3.2(FB) R26.1 R27.2
NetIC3_3: IC3.3(EN) R23.2 R24.2 S2.2(ON)
NetIC3_6: IC3.6(SW_1) IC3.7(SW_2) L3.2 VD3.2(A)

### Notes on the sheet
- DC-DC модуль +10V5
- Подп. и дата
- Инв. № дубл.
- Взам. инв. №
- Инв. № подл.
- Лист
- Изм.
- № докум.
- Подп.
- Дата
- Копировал
- Формат А4

### Library data of the parts
C24 C26 = GRM155R71E104KE14J: as C51-C54 on sheet Модуль питания; Datasheet Link: http://www.murata.com/~/media/webrenewal/support/library/catalog/products/capacitor/mlcc/c02e.pdf; Height: 0.55mm; Manufacturer_Part_Number: GRM155R71E104KE14J; Mouser Part Number: 81-GRM155R71E104KE4J; Mouser Price/Stock: https://www.mouser.co.uk/ProductDetail/Murata-Electronics/GRM155R71E104KE14J?qs=hNud%2FORuBR2EQtvG2InwAQ%3D%3D; Arrow Part Number: GRM155R71E104KE14J; Arrow Price/Stock: https://www.arrow.com/en/products/grm155r71e104ke14j/murata-manufacturing
C25 = TPSA226K006R0300: 22uF Molded Tantalum Capacitors 6.3V 1206 (3216 Metric) 300mOhm @ 100kHz; Manufacturer_Name: AVX; Short Description: 1206 22uF 6V3; Manufacturer_Part_Number: TPSA226K006R0300
C27 = GRM1555C1H102JA01J: as C82 on sheet Модуль ВЧ; Height: 0.55mm; Manufacturer_Part_Number: GRM1555C1H102JA01J
C28 = GRM21BZ71E475KE15L: as C119 on sheet Модуль ВЧ; Datasheet Link: https://search.murata.co.jp/Ceramy/image/img/A01X/G101/ENG/GRM21BZ71E475KE15-01.pdf; Height: 1.45mm; Manufacturer_Part_Number: GRM21BZ71E475KE15L
FB6 = MMZ1005Y400CTD25: as FB12 on sheet Модуль питания; Datasheet Link: https://www.arrow.com/en/products/mmz1005y400ctd25/tdk; Height: 0.55mm; Manufacturer_Part_Number: MMZ1005Y400CTD25; Mouser Part Number: 810-MMZ1005Y400CTD25; Mouser Price/Stock: https://www.mouser.com/Search/Refine.aspx?Keyword=810-MMZ1005Y400CTD25; Arrow Part Number: MMZ1005Y400CTD25; Arrow Price/Stock: https://www.arrow.com/en/products/mmz1005y400ctd25/tdk
FB7 = BLM18SP300SN1D: as FB16 on sheet Модуль ВЧ; Datasheet Link: http://www.murata.com/~/media/webrenewal/support/library/catalog/products/emc/emifil/c31e.ashx?la=en-gb; Height: 0.95mm; Manufacturer_Part_Number: BLM18SP300SN1D; Mouser Part Number: 81-BLM18SP300SN1D; Mouser Price/Stock: https://www.mouser.co.uk/ProductDetail/Murata-Electronics/BLM18SP300SN1D/?qs=W%2FMpXkg%252BdQ4o%252BOP%252B6m8FYA%3D%3D
IC3 = MP3213DQ-LF-Z: DC/DC Converter / 3...22V 3.5A; Manufacturer_Name: Monolithic Power Systems (MPS); Datasheet Link: https://www.monolithicpower.com/en/documentview/productdocument/index/version/2/document_type/Datasheet/lang/en/sku/MP3213/document_id/1111; Height: 1mm; Manufacturer_Part_Number: MP3213DQ-LF-Z; Mouser Part Number: 946-MP3213DQLFZ; Mouser Price/Stock: https://www.mouser.co.uk/ProductDetail/Monolithic-Power-Systems-MPS/MP3213DQ-LF-Z?qs=rC7bBWoQAAkNszTDCx8XYw%3D%3D; Short Description: 3...22V
L3 = CBC3225T4R7MR: 4.7µH Unshielded Wirewound Inductor 1.01A 130mOhm Max 1210 (3225 Metric) / Current - Saturation (Isat) 1.25A / Current Rating (Amps) 1.01A / Frequency - Self Resonant 70MHz; Manufacturer_Name: Taiyo Yuden; Short Description: 4.7uH 1A 130mOhm; Manufacturer_Part_Number: CBC3225T4R7MR
R23-R27 = RC0402FR-07: as R82-R85 on sheet Модуль ВЧ; Datasheet Link: http://www.yageo.com/documents/recent/PYu-RC0402_51_RoHS_L_6_r.pdf; Height: 0.4mm; Manufacturer_Part_Number: RC0402FR-07; Parameter 1: *
S2 = SLG59M309V: Power Switch/Driver 1:1 N-Channel 4A  7.8mOhm 8-FC-TDFN (1.5x2); Manufacturer_Name: Dialog Semiconductor GmbH; Manufacturer_Part_Number: SLG59M309V
VD3 = CCS15S40,L3F: as VD7 on sheet Модуль питания; Manufacturer_Part_Number: CCS15S40,L3F

## Nets that join several sheets
+3V3: 7М07110 Э3 (C12.2 FB2.1 R1.2), DC-DC модуль +3V3 (6 pins), DC-DC модуль +14V (FB4.2), Ethernet модуль (FB24.2), Модуль MCU (FB14.2 FB15.1 VD8.2), Модуль MMI (8 pins), Радиомодуль (FB17.1 FB18.1), Модуль ВЧ (6 pins), Модуль питания (FB12.2), DC-DC модуль +10V5 (FB6.2)
+10V5: Модуль ВЧ (FB16.2), DC-DC модуль +10V5 (C28.2 R26.2 VD3.1)
+14V: DC-DC модуль +14V (C23.2 R21.2 VD2.1), Модуль MMI (FB11.2)
+PS: 7М07110 Э3 (C11.1 FB1.1), Модуль питания (5 pins)
+PWR: DC-DC модуль +3V3 (FB3.1), DC-DC модуль +14V (FB5.1), DC-DC модуль -5V (FB8.1), Модуль MMI (R44.1), Модуль питания (5 pins), DC-DC модуль +10V5 (FB7.1)
-5V: DC-DC модуль -5V (5 pins), Модуль ВЧ (R85.2)
GND: 7М07110 Э3 (18 pins), DC-DC модуль +3V3 (10 pins), DC-DC модуль +14V (11 pins), DC-DC модуль -5V (8 pins), Ethernet модуль (40 pins), Модуль MCU (41 pins), Модуль MMI (26 pins), Радиомодуль (20 pins), Модуль ВЧ (110 pins), Модуль питания (23 pins), DC-DC модуль +10V5 (11 pins)
PS_3V3_ON: 7М07110 Э3 (VD1.1), DC-DC модуль +3V3 (R12.1), Модуль MMI (VD5.1)
PS_10V5_ON: Модуль MCU (IC7.J5), DC-DC модуль +10V5 (R23.1)
PS_14V_ON: DC-DC модуль +14V (R18.1), Модуль MCU (IC7.L6)
PS_-5V_ON: DC-DC модуль -5V (R28.1), Модуль MCU (IC7.E3)
NetC1_1: 7М07110 Э3 (C1.1 R1.1 R2.1), Модуль MCU (IC7.D13)
NetC2_1: 7М07110 Э3 (C2.1 R3.1), Модуль MCU (IC7.E13)
NetC3_1: 7М07110 Э3 (C3.1 R8.1), Модуль MCU (IC7.A6)
NetC4_1: 7М07110 Э3 (C4.1 R11.1), Модуль MCU (IC7.K7)
NetC5_1: 7М07110 Э3 (C5.1 R4.1), Модуль MCU (IC7.D5)
NetC6_1: 7М07110 Э3 (C6.1 R7.1), Модуль MCU (IC7.A10)
NetC7_1: 7М07110 Э3 (C7.1 R10.1), Модуль MCU (C80.1 IC7.H3)
NetC8_1: 7М07110 Э3 (C8.1 R5.1), Модуль MCU (IC7.C5)
NetC9_1: 7М07110 Э3 (C9.1 R6.1), Модуль MCU (IC7.A11)
NetC10_1: 7М07110 Э3 (C10.1 R9.1), Модуль MCU (IC7.D9)
NetC47_1: 7М07110 Э3 (XP2.3 XP2.4), Модуль питания (C47.1 IC5.C3 R56.1 R57.1)
NetC88_1: Радиомодуль (C163.1), Модуль ВЧ (C88.1 C91.1 L11.1)
NetC107_1: Радиомодуль (C161.1), Модуль ВЧ (C107.1 L20.2 L24.1)
NetC162_1: Радиомодуль (C162.1), Модуль ВЧ (IC11.11)
NetC164_1: Радиомодуль (C164.1), Модуль ВЧ (IC8.11)
NetIC7_A4: Модуль MCU (IC7.A4), Модуль питания (R61.1 R62.1)
NetIC7_A5: Ethernet модуль (R117.7), Модуль MCU (IC7.A5)
NetIC7_A9: Модуль MCU (IC7.A9), Радиомодуль (R97.4)
NetIC7_B2: Модуль MCU (IC7.B2), Модуль MMI (R35.1)
NetIC7_B4: Ethernet модуль (R116.2 R123.1), Модуль MCU (IC7.B4)
NetIC7_B5: Ethernet модуль (R117.8), Модуль MCU (IC7.B5)
NetIC7_B7: Ethernet модуль (R117.6), Модуль MCU (IC7.B7)
NetIC7_B8: Модуль MCU (IC7.B8), Модуль MMI (R45.6)
NetIC7_B13: Модуль MCU (IC7.B13), Модуль питания (R58.1 R66.1)
NetIC7_C4: Модуль MCU (IC7.C4), Модуль питания (R72.2 R75.2)
NetIC7_C6: Модуль MCU (IC7.C6), Модуль питания (R63.1)
NetIC7_C7: Модуль MCU (IC7.C7), Модуль MMI (R47.7)
NetIC7_C8: Модуль MCU (IC7.C8), Модуль MMI (R45.5)
NetIC7_C9: Модуль MCU (IC7.C9), Модуль питания (R60.1 R64.1)
NetIC7_D1: Модуль MCU (IC7.D1), Модуль MMI (S3.1)
NetIC7_D2: Модуль MCU (IC7.D2), Модуль MMI (R35.3)
NetIC7_D3: Модуль MCU (IC7.D3), Модуль MMI (R35.2)
NetIC7_D4: Модуль MCU (IC7.D4), Модуль питания (R71.2 R76.2)
NetIC7_D6: Модуль MCU (IC7.D6), Модуль ВЧ (L45.1)
NetIC7_D7: Модуль MCU (IC7.D7), Модуль MMI (R47.8)
NetIC7_E4: Модуль MCU (IC7.E4), Модуль MMI (R49.1)
NetIC7_E7: Модуль MCU (IC7.E7), Модуль питания (R59.1 R65.1)
NetIC7_E8: Ethernet модуль (R121.2), Модуль MCU (IC7.E8)
NetIC7_E11: Ethernet модуль (R115.2 R122.1), Модуль MCU (IC7.E11)
NetIC7_F3: Модуль MCU (IC7.F3), Модуль ВЧ (L37.1)
NetIC7_F4: Модуль MCU (IC7.F4), Модуль ВЧ (L10.1)
NetIC7_F5: Модуль MCU (IC7.F5), Модуль MMI (R43.2)
NetIC7_F6: Ethernet модуль (R117.5 R120.1), Модуль MCU (IC7.F6)
NetIC7_F7: Модуль MCU (IC7.F7), Модуль MMI (R47.6)
NetIC7_F11: Модуль MCU (IC7.F11), Радиомодуль (R95.2)
NetIC7_G3: Модуль MCU (IC7.G3), Модуль ВЧ (L33.1)
NetIC7_G6: Модуль MCU (IC7.G6), Модуль ВЧ (L44.1)
NetIC7_G7: Модуль MCU (IC7.G7), Радиомодуль (R97.3)
NetIC7_G8: Модуль MCU (IC7.G8), Радиомодуль (R97.2)
NetIC7_G9: Модуль MCU (IC7.G9), Модуль ВЧ (L17.1)
NetIC7_H5: Модуль MCU (IC7.H5), Модуль ВЧ (L18.1)
NetIC7_H6: Модуль MCU (IC7.H6), Модуль MMI (R46.5)
NetIC7_H9: Модуль MCU (IC7.H9), Радиомодуль (R97.1)
NetIC7_H10: Модуль MCU (IC7.H10), Модуль MMI (R45.7)
NetIC7_H11: Модуль MCU (IC7.H11), Модуль MMI (R45.8)
NetIC7_J6: Модуль MCU (IC7.J6), Модуль MMI (R46.6)
NetIC7_J7: Модуль MCU (IC7.J7), Модуль питания (R73.2 R74.2)
NetIC7_J9: Модуль MCU (IC7.J9), Модуль MMI (R47.5)
NetIC7_K4: Модуль MCU (IC7.K4), Радиомодуль (R96.2)
NetIC7_K6: Модуль MCU (IC7.K6), Модуль MMI (R46.7)
NetIC7_L3: Модуль MCU (IC7.L3), Радиомодуль (R95.3)
NetIC7_L4: Модуль MCU (IC7.L4), Радиомодуль (R96.1)
NetIC7_L7: Модуль MCU (IC7.L7), Модуль MMI (R46.8)
NetIC7_L8: Модуль MCU (IC7.L8), Радиомодуль (R95.1)
NetIC7_L10: 7М07110 Э3 (VD1.2), Модуль MCU (IC7.L10)
NetIC7_M1: Модуль MCU (IC7.M1), Модуль MMI (R37.1)
NetIC7_M2: Модуль MCU (IC7.M2), Модуль MMI (R36.1)
NetIC7_M4: Модуль MCU (IC7.M4), Радиомодуль (R95.4)
NetIC7_M8: Модуль MCU (IC7.M8), Радиомодуль (R96.4)
NetIC7_N1: Модуль MCU (IC7.N1), Модуль MMI (R38.1)
NetIC7_N2: Модуль MCU (IC7.N2), Модуль ВЧ (R84.2)
NetIC7_N4: Модуль MCU (IC7.N4), Модуль ВЧ (L19.1)
NetIC7_N5: Модуль MCU (IC7.N5), Модуль ВЧ (L31.1)
NetIC7_N6: Модуль MCU (IC7.N6), Модуль ВЧ (L32.1)
NetIC7_N8: Модуль MCU (IC7.N8), Радиомодуль (R96.3)
NetIC13_11: 7М07110 Э3 (XW1.1), Модуль ВЧ (IC13.11)
NetR50_1: 7М07110 Э3 (XP2.1 XP2.2), Модуль MCU (R81.1), Модуль питания (R50.1)
RX+: 7М07110 Э3 (XS1.A3), Ethernet модуль (T1.11)
RX-: 7М07110 Э3 (XS1.A2), Ethernet модуль (T1.9)
TX+: 7М07110 Э3 (XS1.A11), Ethernet модуль (T1.16)
TX-: 7М07110 Э3 (XS1.A10), Ethernet модуль (T1.14)